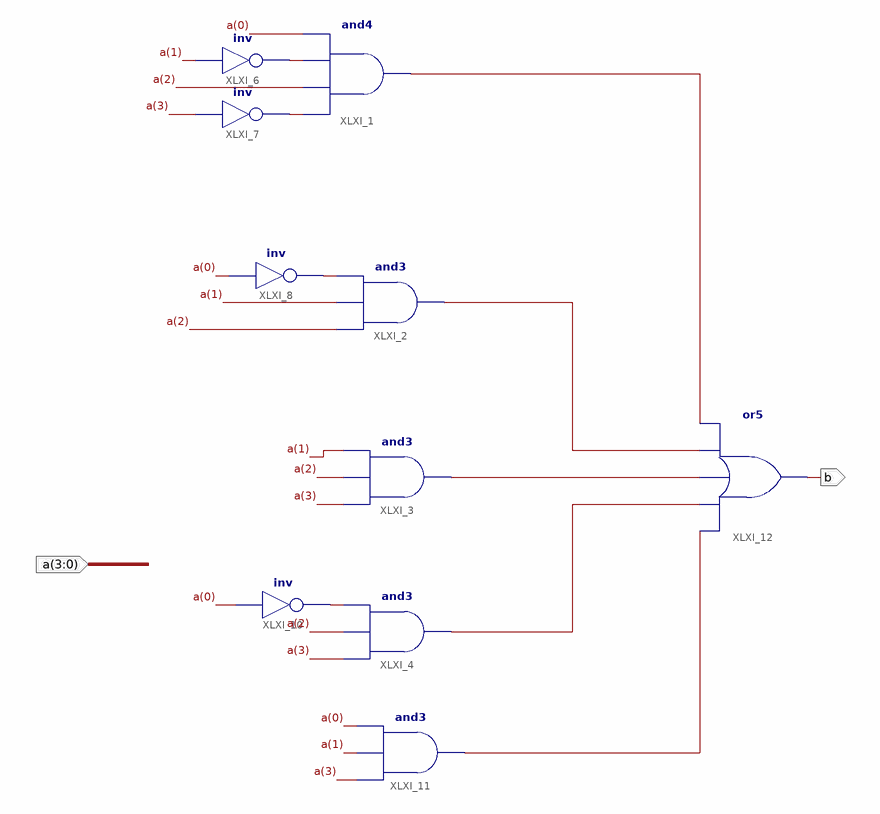
[diagram p0: schematic sheet 1]
// Xilinx ISE schematic b.sch (artix7) as structural Verilog: 10 symbols, 2 ports
module b (
  input  [3:0] a,
  output b
);

  wire XLXN_2, XLXN_3, XLXN_4, XLXN_5, XLXN_22, XLXN_23, XLXN_24, XLXN_25, XLXN_26;

  and XLXI_1 (XLXN_22, XLXN_3, a[2], XLXN_2, a[0]);
  and XLXI_2 (XLXN_23, a[2], a[1], XLXN_4);
  and XLXI_3 (XLXN_24, a[3], a[2], a[1]);
  and XLXI_4 (XLXN_25, a[3], a[2], XLXN_5);
  not XLXI_6 (XLXN_2, a[1]);
  not XLXI_7 (XLXN_3, a[3]);
  not XLXI_8 (XLXN_4, a[0]);
  not XLXI_10 (XLXN_5, a[0]);
  and XLXI_11 (XLXN_26, a[3], a[1], a[0]);
  or XLXI_12 (b, XLXN_26, XLXN_25, XLXN_24, XLXN_23, XLXN_22);
endmodule
